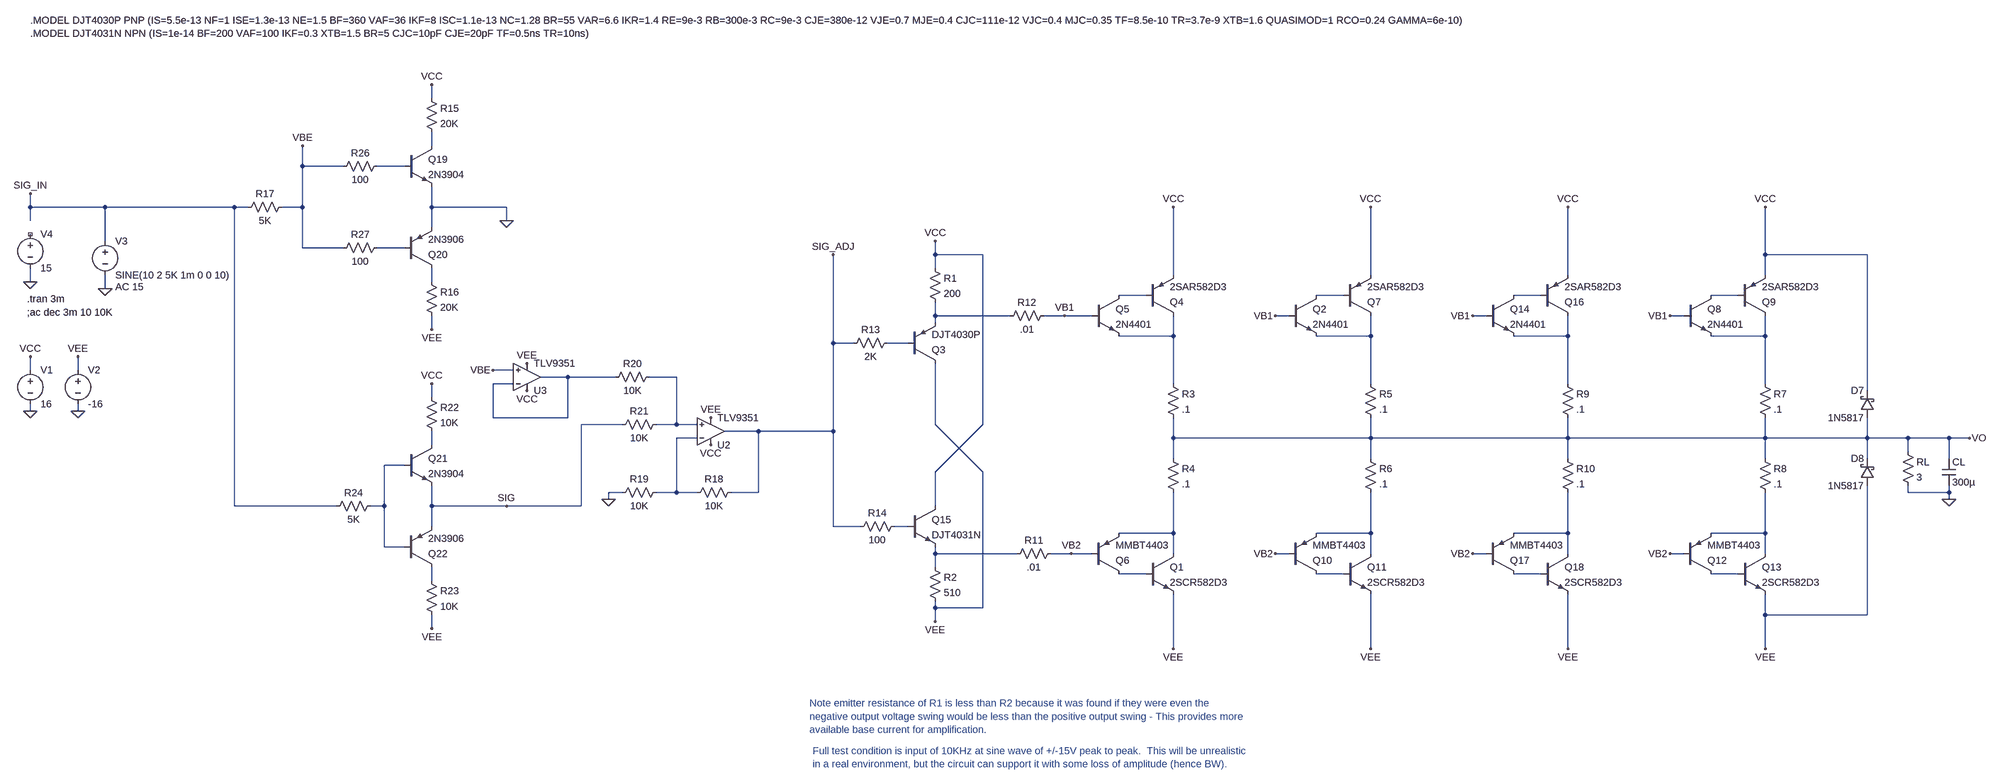
[diagram p0: schematic Current Amplifier-1_REV_30.asc]
Current Amplifier-1_REV_30.asc, the LTspice schematic file:
Version 4
SHEET 1 3044 1336
WIRE -1104 -496 -1104 -528
WIRE -1104 -384 -1104 -416
WIRE -1408 -336 -1408 -384
WIRE -1312 -336 -1408 -336
WIRE -1168 -336 -1232 -336
WIRE -2048 -240 -2048 -272
WIRE -1872 -240 -2048 -240
WIRE -1568 -240 -1872 -240
WIRE -1536 -240 -1568 -240
WIRE -1408 -240 -1408 -336
WIRE -1408 -240 -1456 -240
WIRE -1104 -240 -1104 -288
WIRE -928 -240 -1104 -240
WIRE -2048 -208 -2048 -240
WIRE -928 -208 -928 -240
WIRE -1104 -192 -1104 -240
WIRE -1872 -160 -1872 -240
WIRE -1408 -144 -1408 -240
WIRE -1312 -144 -1408 -144
WIRE -1168 -144 -1232 -144
WIRE 80 -128 80 -160
WIRE 192 -128 80 -128
WIRE 2032 -128 2032 -240
WIRE 2272 -128 2032 -128
WIRE 80 -96 80 -128
WIRE 640 -80 640 -240
WIRE 1104 -80 1104 -240
WIRE 1568 -80 1568 -240
WIRE 2032 -80 2032 -128
WIRE -2048 -64 -2048 -96
WIRE -1104 -64 -1104 -96
WIRE -1872 -48 -1872 -80
WIRE 576 -32 512 -32
WIRE 1040 -32 976 -32
WIRE 1504 -32 1440 -32
WIRE 1968 -32 1904 -32
WIRE 80 16 80 -16
WIRE 256 16 80 16
WIRE 384 16 336 16
WIRE 448 16 384 16
WIRE 912 16 880 16
WIRE 1376 16 1344 16
WIRE 1840 16 1808 16
WIRE 80 32 80 16
WIRE -1104 48 -1104 16
WIRE 640 64 640 16
WIRE 640 64 512 64
WIRE 1104 64 1104 16
WIRE 1104 64 976 64
WIRE 1568 64 1568 16
WIRE 1568 64 1440 64
WIRE 2032 64 2032 16
WIRE 2032 64 1904 64
WIRE -160 80 -160 -128
WIRE -112 80 -160 80
WIRE 16 80 -32 80
WIRE -2048 144 -2048 112
WIRE -1936 144 -1936 112
WIRE -912 144 -960 144
WIRE -784 160 -848 160
WIRE -672 160 -784 160
WIRE -528 160 -592 160
WIRE -912 176 -960 176
WIRE 640 176 640 64
WIRE 1104 176 1104 64
WIRE 1568 176 1568 64
WIRE 2032 176 2032 64
WIRE 2272 192 2272 -128
WIRE -1104 208 -1104 176
WIRE -2048 240 -2048 224
WIRE -1936 240 -1936 224
WIRE -960 256 -960 176
WIRE -784 256 -784 160
WIRE -784 256 -960 256
WIRE -656 272 -752 272
WIRE -528 272 -528 160
WIRE -528 272 -576 272
WIRE -480 272 -528 272
WIRE 80 272 80 128
WIRE 192 272 192 -128
WIRE -336 288 -416 288
WIRE -160 288 -160 80
WIRE -160 288 -336 288
WIRE -480 304 -528 304
WIRE 640 304 640 256
WIRE 1104 304 1104 256
WIRE 1104 304 640 304
WIRE 1568 304 1568 256
WIRE 1568 304 1104 304
WIRE 2032 304 2032 256
WIRE 2032 304 1568 304
WIRE 2272 304 2272 256
WIRE 2272 304 2032 304
WIRE 2368 304 2272 304
WIRE 2464 304 2368 304
WIRE 2512 304 2464 304
WIRE -1104 320 -1104 288
WIRE 2368 336 2368 304
WIRE 640 352 640 304
WIRE 1104 352 1104 304
WIRE 1568 352 1568 304
WIRE 2032 352 2032 304
WIRE 2272 352 2272 304
WIRE 2464 352 2464 304
WIRE -1168 368 -1216 368
WIRE 80 384 192 272
WIRE 192 384 80 272
WIRE -656 432 -688 432
WIRE -528 432 -528 304
WIRE -528 432 -576 432
WIRE -480 432 -528 432
WIRE -336 432 -336 288
WIRE -336 432 -400 432
WIRE 2368 432 2368 416
WIRE 2464 432 2464 416
WIRE 2464 432 2368 432
WIRE -688 448 -688 432
WIRE 2464 448 2464 432
WIRE -1568 464 -1568 -240
WIRE -1328 464 -1568 464
WIRE -1216 464 -1216 368
WIRE -1216 464 -1248 464
WIRE -1104 464 -1104 416
WIRE -928 464 -1104 464
WIRE -752 464 -752 272
WIRE -752 464 -928 464
WIRE 80 464 80 384
WIRE -1104 512 -1104 464
WIRE -160 512 -160 288
WIRE -96 512 -160 512
WIRE 16 512 -16 512
WIRE 640 528 640 432
WIRE 640 528 512 528
WIRE 1104 528 1104 432
WIRE 1104 528 976 528
WIRE 1568 528 1568 432
WIRE 1568 528 1440 528
WIRE 2032 528 2032 432
WIRE 2032 528 1904 528
WIRE -1216 560 -1216 464
WIRE -1168 560 -1216 560
WIRE 80 576 80 560
WIRE 272 576 80 576
WIRE 400 576 352 576
WIRE 448 576 400 576
WIRE 640 576 640 528
WIRE 912 576 880 576
WIRE 1104 576 1104 528
WIRE 1376 576 1344 576
WIRE 1568 576 1568 528
WIRE 1840 576 1808 576
WIRE 2032 576 2032 528
WIRE 80 608 80 576
WIRE 576 624 512 624
WIRE 1040 624 976 624
WIRE 1504 624 1440 624
WIRE 1968 624 1904 624
WIRE -1104 640 -1104 608
WIRE 80 704 80 688
WIRE 192 704 192 384
WIRE 192 704 80 704
WIRE 2032 720 2032 672
WIRE 2272 720 2272 416
WIRE 2272 720 2032 720
WIRE 80 736 80 704
WIRE -1104 752 -1104 720
WIRE 640 800 640 672
WIRE 1104 800 1104 672
WIRE 1568 800 1568 672
WIRE 2032 800 2032 720
FLAG -2048 112 VCC
FLAG -1936 112 VEE
FLAG -2048 240 0
FLAG -1936 240 0
FLAG 640 -240 VCC
FLAG 640 800 VEE
FLAG -1872 -48 0
FLAG 2464 448 0
FLAG 2512 304 VO
FLAG 80 -160 VCC
FLAG 80 736 VEE
FLAG 1104 -240 VCC
FLAG 1104 800 VEE
FLAG 384 16 VB1
FLAG 400 576 VB2
FLAG 880 16 VB1
FLAG 880 576 VB2
FLAG 2032 -240 VCC
FLAG 2032 800 VEE
FLAG 1808 16 VB1
FLAG 1808 576 VB2
FLAG -2048 -64 0
FLAG 1568 -240 VCC
FLAG 1568 800 VEE
FLAG 1344 16 VB1
FLAG 1344 576 VB2
FLAG -928 -208 0
FLAG -1104 -528 VCC
FLAG -1104 48 VEE
FLAG -448 320 VCC
FLAG -448 256 VEE
FLAG -880 192 VCC
FLAG -880 128 VEE
FLAG -1104 176 VCC
FLAG -1104 752 VEE
FLAG -688 448 0
FLAG -1408 -384 VBE
FLAG -960 144 VBE
FLAG -2048 -272 SIG_IN
FLAG -160 -128 SIG_ADJ
FLAG -928 464 SIG
SYMBOL voltage -2048 128 R0
WINDOW 123 0 0 Left 0
WINDOW 39 0 0 Left 0
SYMATTR InstName V1
SYMATTR Value 16
SYMBOL voltage -1936 128 R0
WINDOW 123 0 0 Left 0
WINDOW 39 0 0 Left 0
SYMATTR InstName V2
SYMATTR Value -16
SYMBOL res 624 160 R0
SYMATTR InstName R3
SYMATTR Value .1
SYMBOL res 624 336 R0
SYMATTR InstName R4
SYMATTR Value .1
SYMBOL voltage -1872 -176 R0
WINDOW 123 24 124 Left 2
WINDOW 39 0 0 Left 0
SYMATTR Value2 AC 15
SYMATTR InstName V3
SYMATTR Value SINE(10 2 5K 1m 0 0 10)
SYMBOL res 2352 320 R0
SYMATTR InstName RL
SYMATTR Value 3
SYMBOL cap 2448 352 R0
SYMATTR InstName CL
SYMATTR Value 300µ
SYMBOL res 64 -112 R0
SYMATTR InstName R1
SYMATTR Value 200
SYMBOL res 64 592 R0
SYMATTR InstName R2
SYMATTR Value 510
SYMBOL res 1088 160 R0
SYMATTR InstName R5
SYMATTR Value .1
SYMBOL res 1088 336 R0
SYMATTR InstName R6
SYMATTR Value .1
SYMBOL res 2016 160 R0
SYMATTR InstName R7
SYMATTR Value .1
SYMBOL res 2016 336 R0
SYMATTR InstName R8
SYMATTR Value .1
SYMBOL schottky 2288 256 R180
WINDOW 0 24 64 Left 2
WINDOW 3 24 0 Left 2
SYMATTR InstName D7
SYMATTR Value 1N5817
SYMATTR Description Diode
SYMATTR Type diode
SYMBOL schottky 2288 416 R180
WINDOW 0 24 64 Left 2
WINDOW 3 24 0 Left 2
SYMATTR InstName D8
SYMATTR Value 1N5817
SYMATTR Description Diode
SYMATTR Type diode
SYMBOL pnp 448 624 M180
SYMATTR InstName Q6
SYMATTR Value MMBT4403
SYMBOL npn 448 -32 R0
SYMATTR InstName Q5
SYMATTR Value 2N4401
SYMBOL pnp 576 16 M180
SYMATTR InstName Q4
SYMATTR Value 2SAR582D3
SYMBOL npn 576 576 R0
SYMATTR InstName Q1
SYMATTR Value 2SCR582D3
SYMBOL voltage -2048 -192 R0
WINDOW 123 0 0 Left 0
WINDOW 39 0 0 Left 0
SYMATTR InstName V4
SYMATTR Value 15
SYMBOL npn 912 -32 R0
SYMATTR InstName Q2
SYMATTR Value 2N4401
SYMBOL pnp 1040 16 M180
SYMATTR InstName Q7
SYMATTR Value 2SAR582D3
SYMBOL npn 1840 -32 R0
SYMATTR InstName Q8
SYMATTR Value 2N4401
SYMBOL pnp 1968 16 M180
SYMATTR InstName Q9
SYMATTR Value 2SAR582D3
SYMBOL pnp 912 624 M180
SYMATTR InstName Q10
SYMATTR Value MMBT4403
SYMBOL npn 1040 576 R0
SYMATTR InstName Q11
SYMATTR Value 2SCR582D3
SYMBOL pnp 1840 624 M180
SYMATTR InstName Q12
SYMATTR Value MMBT4403
SYMBOL npn 1968 576 R0
SYMATTR InstName Q13
SYMATTR Value 2SCR582D3
SYMBOL res 1552 160 R0
SYMATTR InstName R9
SYMATTR Value .1
SYMBOL res 1552 336 R0
SYMATTR InstName R10
SYMATTR Value .1
SYMBOL npn 1376 -32 R0
SYMATTR InstName Q14
SYMATTR Value 2N4401
SYMBOL pnp 1504 16 M180
SYMATTR InstName Q16
SYMATTR Value 2SAR582D3
SYMBOL pnp 1376 624 M180
SYMATTR InstName Q17
SYMATTR Value MMBT4403
SYMBOL npn 1504 576 R0
SYMATTR InstName Q18
SYMATTR Value 2SCR582D3
SYMBOL res 368 560 R90
WINDOW 0 0 56 VBottom 2
WINDOW 3 32 56 VTop 2
SYMATTR InstName R11
SYMATTR Value .01
SYMBOL res 352 0 R90
WINDOW 0 0 56 VBottom 2
WINDOW 3 32 56 VTop 2
SYMATTR InstName R12
SYMATTR Value .01
SYMBOL npn 16 464 R0
SYMATTR InstName Q15
SYMATTR Value DJT4031N
SYMBOL pnp 16 128 M180
SYMATTR InstName Q3
SYMATTR Value DJT4030P
SYMBOL res -16 64 R90
WINDOW 0 0 56 VBottom 2
WINDOW 3 32 56 VTop 2
SYMATTR InstName R13
SYMATTR Value 2K
SYMBOL res 0 496 R90
WINDOW 0 0 56 VBottom 2
WINDOW 3 32 56 VTop 2
SYMATTR InstName R14
SYMATTR Value 100
SYMBOL npn -1168 -384 R0
SYMATTR InstName Q19
SYMATTR Value 2N3904
SYMBOL pnp -1168 -96 M180
SYMATTR InstName Q20
SYMATTR Value 2N3906
SYMBOL res -1120 -512 R0
SYMATTR InstName R15
SYMATTR Value 20K
SYMBOL res -1120 -80 R0
SYMATTR InstName R16
SYMATTR Value 20K
SYMBOL res -1440 -256 R90
WINDOW 0 0 56 VBottom 2
WINDOW 3 32 56 VTop 2
SYMATTR InstName R17
SYMATTR Value 5K
SYMBOL Hab_OpAmp\\TLV9351 -448 352 M180
SYMATTR InstName U2
SYMBOL res -384 416 R90
WINDOW 0 0 56 VBottom 2
WINDOW 3 32 56 VTop 2
SYMATTR InstName R18
SYMATTR Value 10K
SYMBOL res -560 416 R90
WINDOW 0 0 56 VBottom 2
WINDOW 3 32 56 VTop 2
SYMATTR InstName R19
SYMATTR Value 10K
SYMBOL res -576 144 R90
WINDOW 0 0 56 VBottom 2
WINDOW 3 32 56 VTop 2
SYMATTR InstName R20
SYMATTR Value 10K
SYMBOL res -560 256 R90
WINDOW 0 0 56 VBottom 2
WINDOW 3 32 56 VTop 2
SYMATTR InstName R21
SYMATTR Value 10K
SYMBOL Hab_OpAmp\\TLV9351 -880 224 M180
SYMATTR InstName U3
SYMBOL npn -1168 320 R0
SYMATTR InstName Q21
SYMATTR Value 2N3904
SYMBOL pnp -1168 608 M180
SYMATTR InstName Q22
SYMATTR Value 2N3906
SYMBOL res -1120 192 R0
SYMATTR InstName R22
SYMATTR Value 10K
SYMBOL res -1120 624 R0
SYMATTR InstName R23
SYMATTR Value 10K
SYMBOL res -1232 448 R90
WINDOW 0 0 56 VBottom 2
WINDOW 3 32 56 VTop 2
SYMATTR InstName R24
SYMATTR Value 5K
SYMBOL res -1216 -352 R90
WINDOW 0 0 56 VBottom 2
WINDOW 3 32 56 VTop 2
SYMATTR InstName R26
SYMATTR Value 100
SYMBOL res -1216 -160 R90
WINDOW 0 0 56 VBottom 2
WINDOW 3 32 56 VTop 2
SYMATTR InstName R27
SYMATTR Value 100
TEXT -2056 -24 Left 2 !.tran 3m
TEXT -2056 8 Left 2 !;ac dec 3m 10 10K
TEXT -216 928 Left 2 ;Note emitter resistance of R1 is less than R2 because it was found if they were even the\nnegative output voltage swing would be less than the positive output swing - This provides more \navailable base current for amplification.
TEXT -208 1040 Left 2 ;Full test condition is input of 10KHz at sine wave of +/-15V peak to peak.  This will be unrealistic\nin a real environment, but the circuit can support it with some loss of amplitude (hence BW).
TEXT -2048 -680 Left 2 !.MODEL DJT4030P PNP (IS=5.5e-13 NF=1 ISE=1.3e-13 NE=1.5 BF=360 VAF=36 IKF=8 ISC=1.1e-13 NC=1.28 BR=55 VAR=6.6 IKR=1.4 RE=9e-3 RB=300e-3 RC=9e-3 CJE=380e-12 VJE=0.7 MJE=0.4 CJC=111e-12 VJC=0.4 MJC=0.35 TF=8.5e-10 TR=3.7e-9 XTB=1.6 QUASIMOD=1 RCO=0.24 GAMMA=6e-10)\n.MODEL DJT4031N NPN (IS=1e-14 BF=200 VAF=100 IKF=0.3 XTB=1.5 BR=5 CJC=10pF CJE=20pF TF=0.5ns TR=10ns)

The netlist it stands for:
* Current Amplifier-1_REV_30.asc
V1 VCC 0 16
V2 VEE 0 -16
R3 N010 VO .1
R4 VO N021 .1
V3 SIG_IN 0 SINE(10 2 5K 1m 0 0 10) AC 15
RL VO 0 3
CL VO 0 300µ
R1 VCC N009 200
R2 N025 VEE 510
R5 N011 VO .1
R6 VO N022 .1
R7 N013 VO .1
R8 VO N024 .1
D7 VO VCC 1N5817
D8 VEE VO 1N5817
Q6 N026 VB2 N021 0 MMBT4403
Q5 N005 VB1 N010 0 2N4401
Q4 N010 N005 VCC 0 2SAR582D3
Q1 N021 N026 VEE 0 2SCR582D3
V4 NC_01 0 15
Q2 N006 VB1 N011 0 2N4401
Q7 N011 N006 VCC 0 2SAR582D3
Q8 N008 VB1 N013 0 2N4401
Q9 N013 N008 VCC 0 2SAR582D3
Q10 N027 VB2 N022 0 MMBT4403
Q11 N022 N027 VEE 0 2SCR582D3
Q12 N029 VB2 N024 0 MMBT4403
Q13 N024 N029 VEE 0 2SCR582D3
R9 N012 VO .1
R10 VO N023 .1
Q14 N007 VB1 N012 0 2N4401
Q16 N012 N007 VCC 0 2SAR582D3
Q17 N028 VB2 N023 0 MMBT4403
Q18 N023 N028 VEE 0 2SCR582D3
R11 VB2 N025 .01
R12 VB1 N009 .01
Q15 VCC N020 N025 0 DJT4031N
Q3 VEE N014 N009 0 DJT4030P
R13 N014 SIG_ADJ 2K
R14 N020 SIG_ADJ 100
Q19 N001 N002 0 0 2N3904
Q20 N004 N003 0 0 2N3906
R15 VCC N001 20K
R16 N004 VEE 20K
R17 VBE SIG_IN 5K
* U2: TLV9351 (symbol Hab_OpAmp\TLV9351 not available, pins judged from their places): In+=N016 In-=N017 V+=VCC V-=VEE OUT=SIG_ADJ
R18 SIG_ADJ N017 10K
R19 N017 0 10K
R20 N016 N015 10K
R21 N016 SIG 10K
* U3: TLV9351 (symbol Hab_OpAmp\TLV9351 not available, pins judged from their places): In+=VBE In-=N015 V+=VCC V-=VEE OUT=N015
Q21 N018 N019 SIG 0 2N3904
Q22 N030 N019 SIG 0 2N3906
R22 VCC N018 10K
R23 N030 VEE 10K
R24 N019 SIG_IN 5K
R26 N002 VBE 100
R27 N003 VBE 100
.model D D
.lib standard.dio
.model NPN NPN
.model PNP PNP
.lib standard.bjt
.tran 3m
;ac dec 3m 10 10K
* Note emitter resistance of R1 is less than R2 because it was found if they were even the
* negative output voltage swing would be less than the positive output swing - This provides more
* available base current for amplification.
* Full test condition is input of 10KHz at sine wave of +/-15V peak to peak.  This will be unrealistic
* in a real environment, but the circuit can support it with some loss of amplitude (hence BW).
.MODEL DJT4030P PNP (IS=5.5e-13 NF=1 ISE=1.3e-13 NE=1.5 BF=360 VAF=36 IKF=8 ISC=1.1e-13 NC=1.28 BR=55 VAR=6.6 IKR=1.4 RE=9e-3 RB=300e-3 RC=9e-3 CJE=380e-12 VJE=0.7 MJE=0.4 CJC=111e-12 VJC=0.4 MJC=0.35 TF=8.5e-10 TR=3.7e-9 XTB=1.6 QUASIMOD=1 RCO=0.24 GAMMA=6e-10)
.MODEL DJT4031N NPN (IS=1e-14 BF=200 VAF=100 IKF=0.3 XTB=1.5 BR=5 CJC=10pF CJE=20pF TF=0.5ns TR=10ns)
.backanno
.end